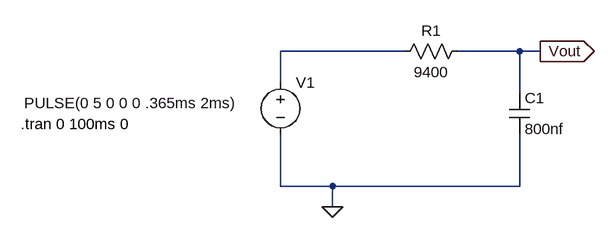
[diagram p0: schematic lab_4_schematic.asc]
lab_4_schematic.asc, the LTspice schematic file:
Version 4
SHEET 1 880 680
WIRE 256 80 64 80
WIRE 432 80 336 80
WIRE 464 80 432 80
WIRE 64 128 64 80
WIRE 432 144 432 80
WIRE 64 288 64 208
WIRE 144 288 64 288
WIRE 432 288 432 208
WIRE 432 288 144 288
WIRE 144 320 144 288
FLAG 144 320 0
FLAG 464 80 Vout
IOPIN 464 80 Out
SYMBOL voltage 64 112 R0
WINDOW 3 -395 48 Left 2
WINDOW 123 0 0 Left 0
WINDOW 39 0 0 Left 0
SYMATTR Value PULSE(0 5 0 0 0 .365ms 2ms)
SYMATTR InstName V1
SYMBOL res 352 64 R90
WINDOW 0 0 56 VBottom 2
WINDOW 3 32 56 VTop 2
SYMATTR InstName R1
SYMATTR Value 9400
SYMBOL cap 416 144 R0
SYMATTR InstName C1
SYMATTR Value 800nf
TEXT -336 192 Left 2 !.tran 0 100ms 0

The netlist it stands for:
* lab_4_schematic.asc
V1 N001 0 PULSE(0 5 0 0 0 .365ms 2ms)
R1 Vout N001 9400
C1 Vout 0 800nf
.tran 0 100ms 0
.backanno
.end